# Altium schematic sheet var_03_scheme.SchDoc
size A4; SheetNumber: 3; SheetTotal: 10
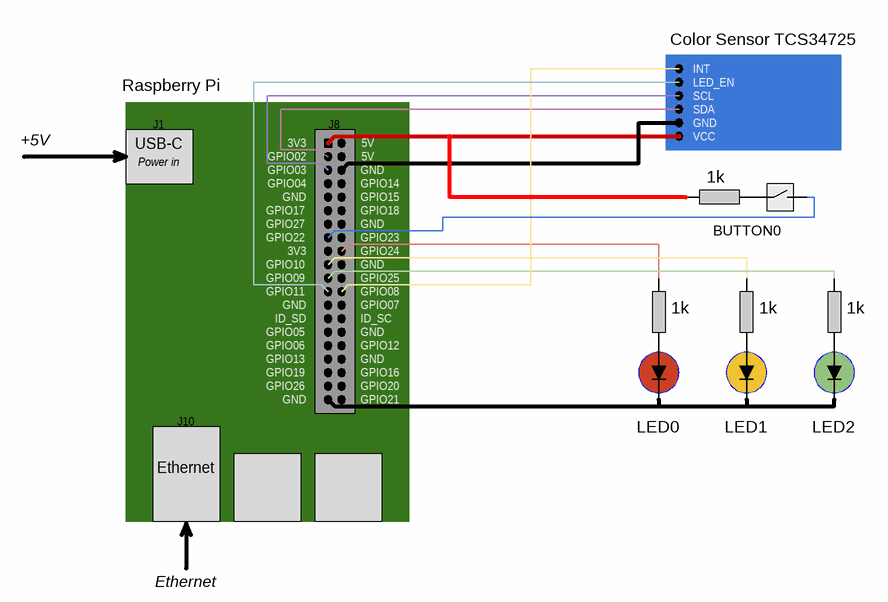
[diagram p0: var_03_scheme.SchDoc]

## Notes on the sheet
- Color Sensor TCS34725
- Raspberry Pi
- INT
- LED_EN
- SCL
- +5V
- USB-C
- Power in
- J1
- 3V3
- GPIO02
- GPIO03
- J8
- GND
- 5V
- SDA
- VCC
- 1k
- GPIO17
- GPIO27
- GPIO22
- GPIO04
- GPIO14
- GPIO15
- GPIO18
- GPIO23
- BUTTON0
- GPIO09
- GPIO10
- GPIO11
- GPIO24
- GPIO25
- GPIO08
- GPIO07
- GPIO05
- GPIO06
- GPIO13
- GPIO19
- ID_SD
- ID_SC
- GPIO12
- GPIO16
- J10
- GPIO26
- GPIO20
- GPIO21
- LED0
- LED1
- LED2
- Ethernet